# Altium schematic sheet ft232.SchDoc
size A; SheetNumber: 2; SheetTotal: 7
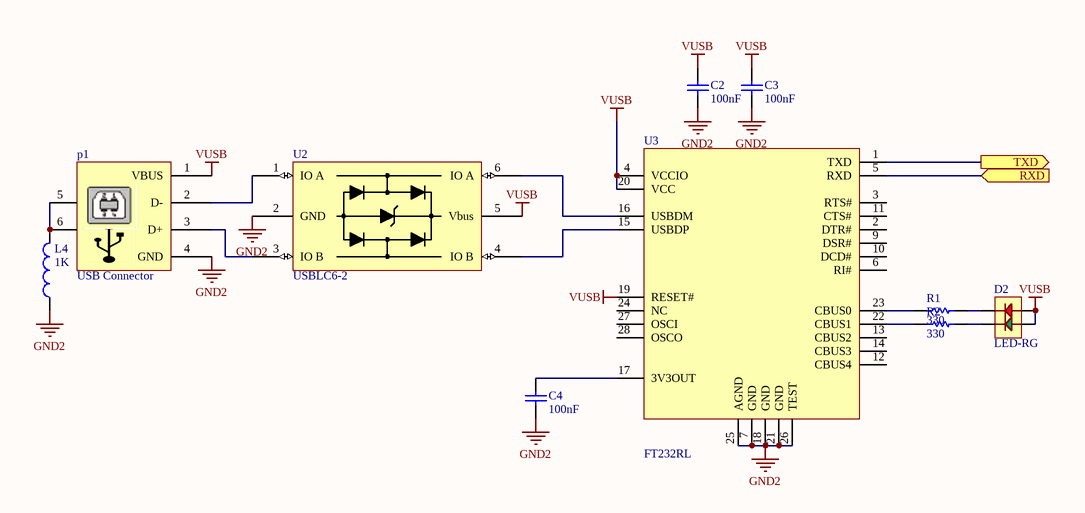
[diagram p0: ft232.SchDoc]

## Parts
C2  100nF  [C805]
C3  100nF  [C805]
C4  100nF  [C805]
D2  LED-RG  [LED-1210]
L4  1K  [r805]
p1  USB Connector  [USB2-B-R]
R1  330  [R0603]
R2  330  [R0603]
U2  USBLC6-2  [SOT-23-6]
U3  FT232RL  [SSOP-28N]

## Ports
RXD (in), TXD (out)

## Nets
GND2: C2.1 C3.1 C4.1 L4.1 p1.4(GND) U2.2(GND) U3.7(GND) U3.18(GND) U3.21(GND) U3.25(AGND) U3.26(TEST)
VUSB: C2.2 C3.2 D2.1(GRN-A) D2.2(RED-A) p1.1(VBUS) U2.5(Vbus) U3.4(VCCIO) U3.19(RESET#) U3.20(VCC)
RXD: U3.5(RXD) ; port RXD
TXD: U3.1(TXD) ; port TXD
NetC4_2: C4.2 U3.17(3V3OUT)
NetD2_3: D2.3(RED-C) R1.2
NetD2_4: D2.4(GRN-C) R2.2
NetL4_2: L4.2 p1.5 p1.6
Netp1_2: p1.2(D-) U2.1(IO_A)
Netp1_3: p1.3(D+) U2.3(IO_B)
NetR1_1: R1.1 U3.23(CBUS0)
NetR2_1: R2.1 U3.22(CBUS1)
NetU2_4: U2.4(IO_B) U3.15(USBDP)
NetU2_6: U2.6(IO_A) U3.16(USBDM)

Not connected (* = marked no-connect by the designer): U3 2(DTR#) 3(RTS#) 6(RI#) 8(NC) 9(DSR#) 10(DCD#) 11(CTS#) 12(CBUS4) 13(CBUS2) 14(CBUS3) 24(NC) 27(OSCI) 28(OSCO)

## Library data of the parts
C2-C4 = Cap: Capacitor; Designer: Parsa Malekpour; Value: 100nF
D2 = LED-RG-4
L4 = Ferrite Bead: Code_IEC: 1005; Published: 8-Jun-2000; LatestRevisionDate: 29-May-2009; LatestRevisionNote: IPC-7351 Footprint Added.; Publisher: Altium Limited; PackageDescription: Chip Inductor; Code_JEITA: 0402; Value: 1K
p1 = USB2-B: USB Connector-B Type; Designer: Eng. Saeid Jorablo; Company: DASE Co; Adding Date: 10/26/2010
R1 R2 = Resistor: Designer: Parsa Malekpour; Value: 330
U2 = USBLC6-2: Very low capacitance ESD protection